# EAGLE design S7G7_footprint_simplified_w_ethernet_v1p12 (EAGLE 9.5.2)
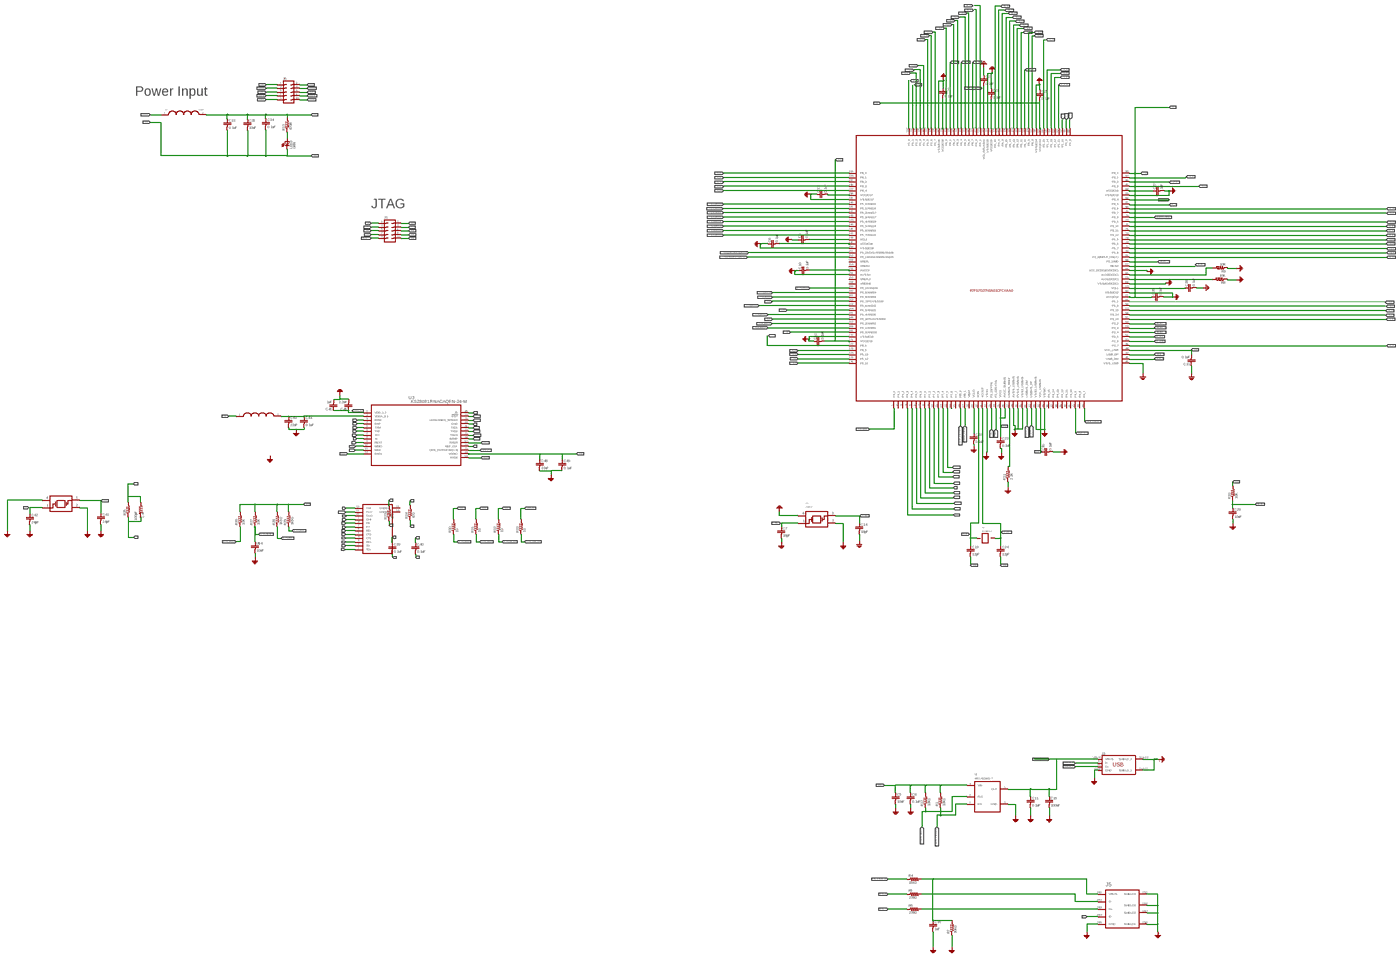
[diagram p0: schematic, sheet 1, overview]
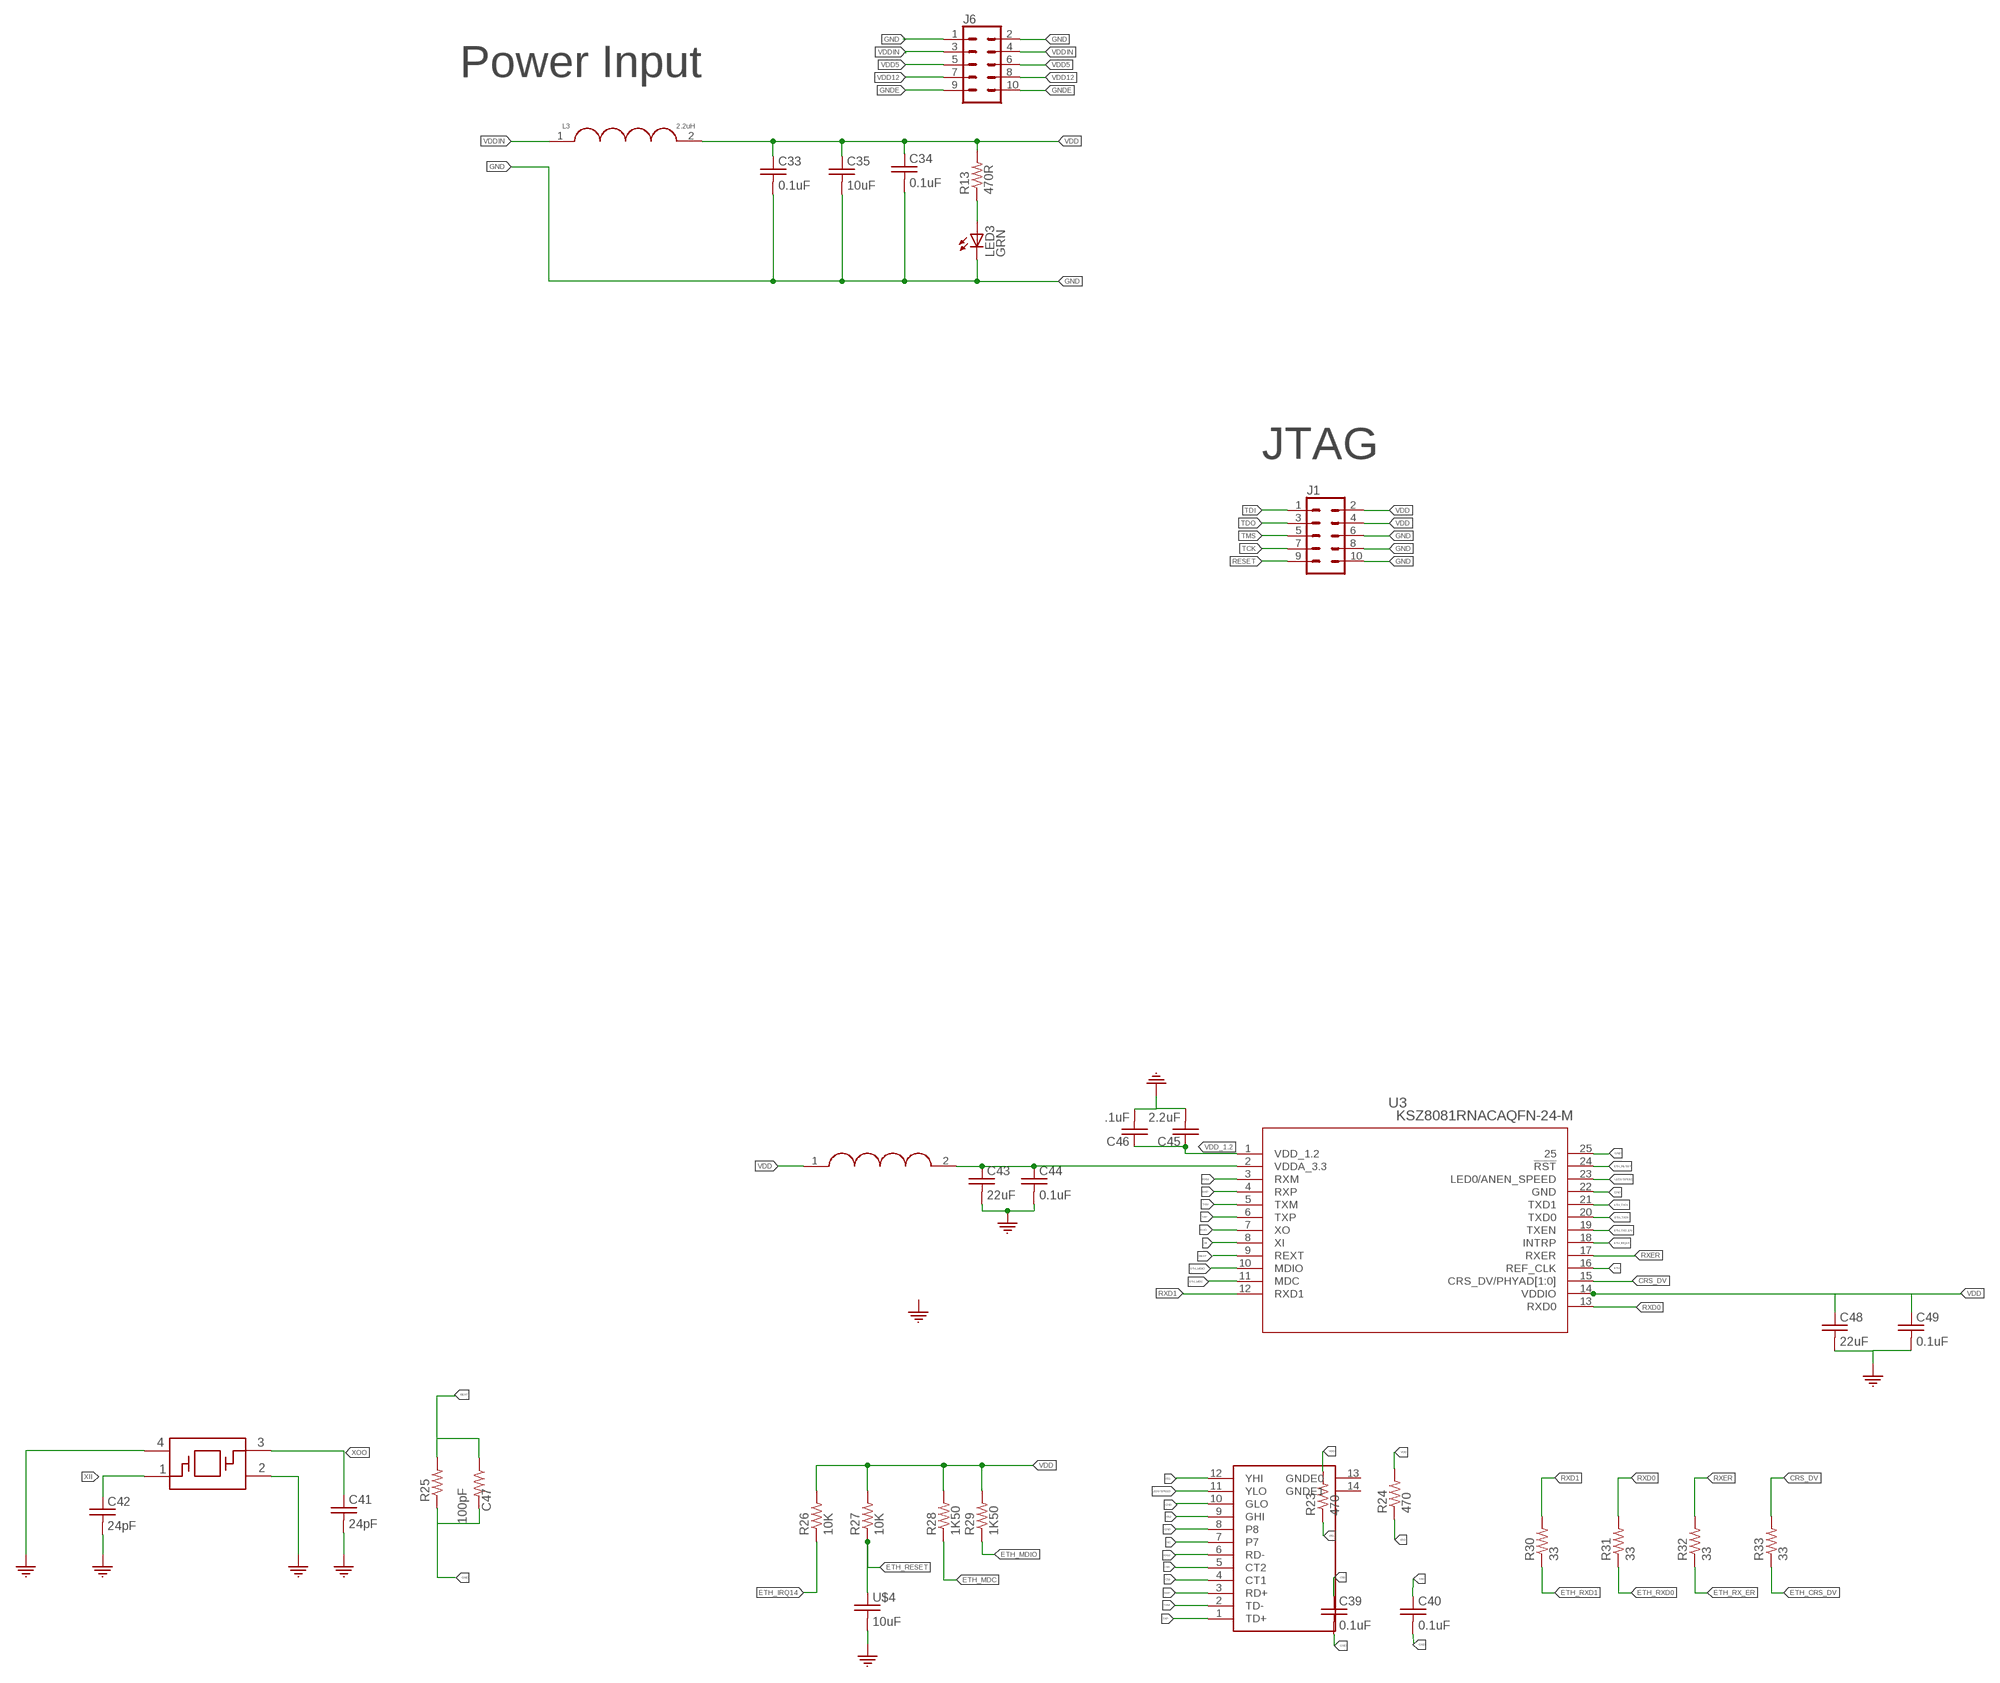
[diagram p1: schematic, sheet 1, part 1 of 4]
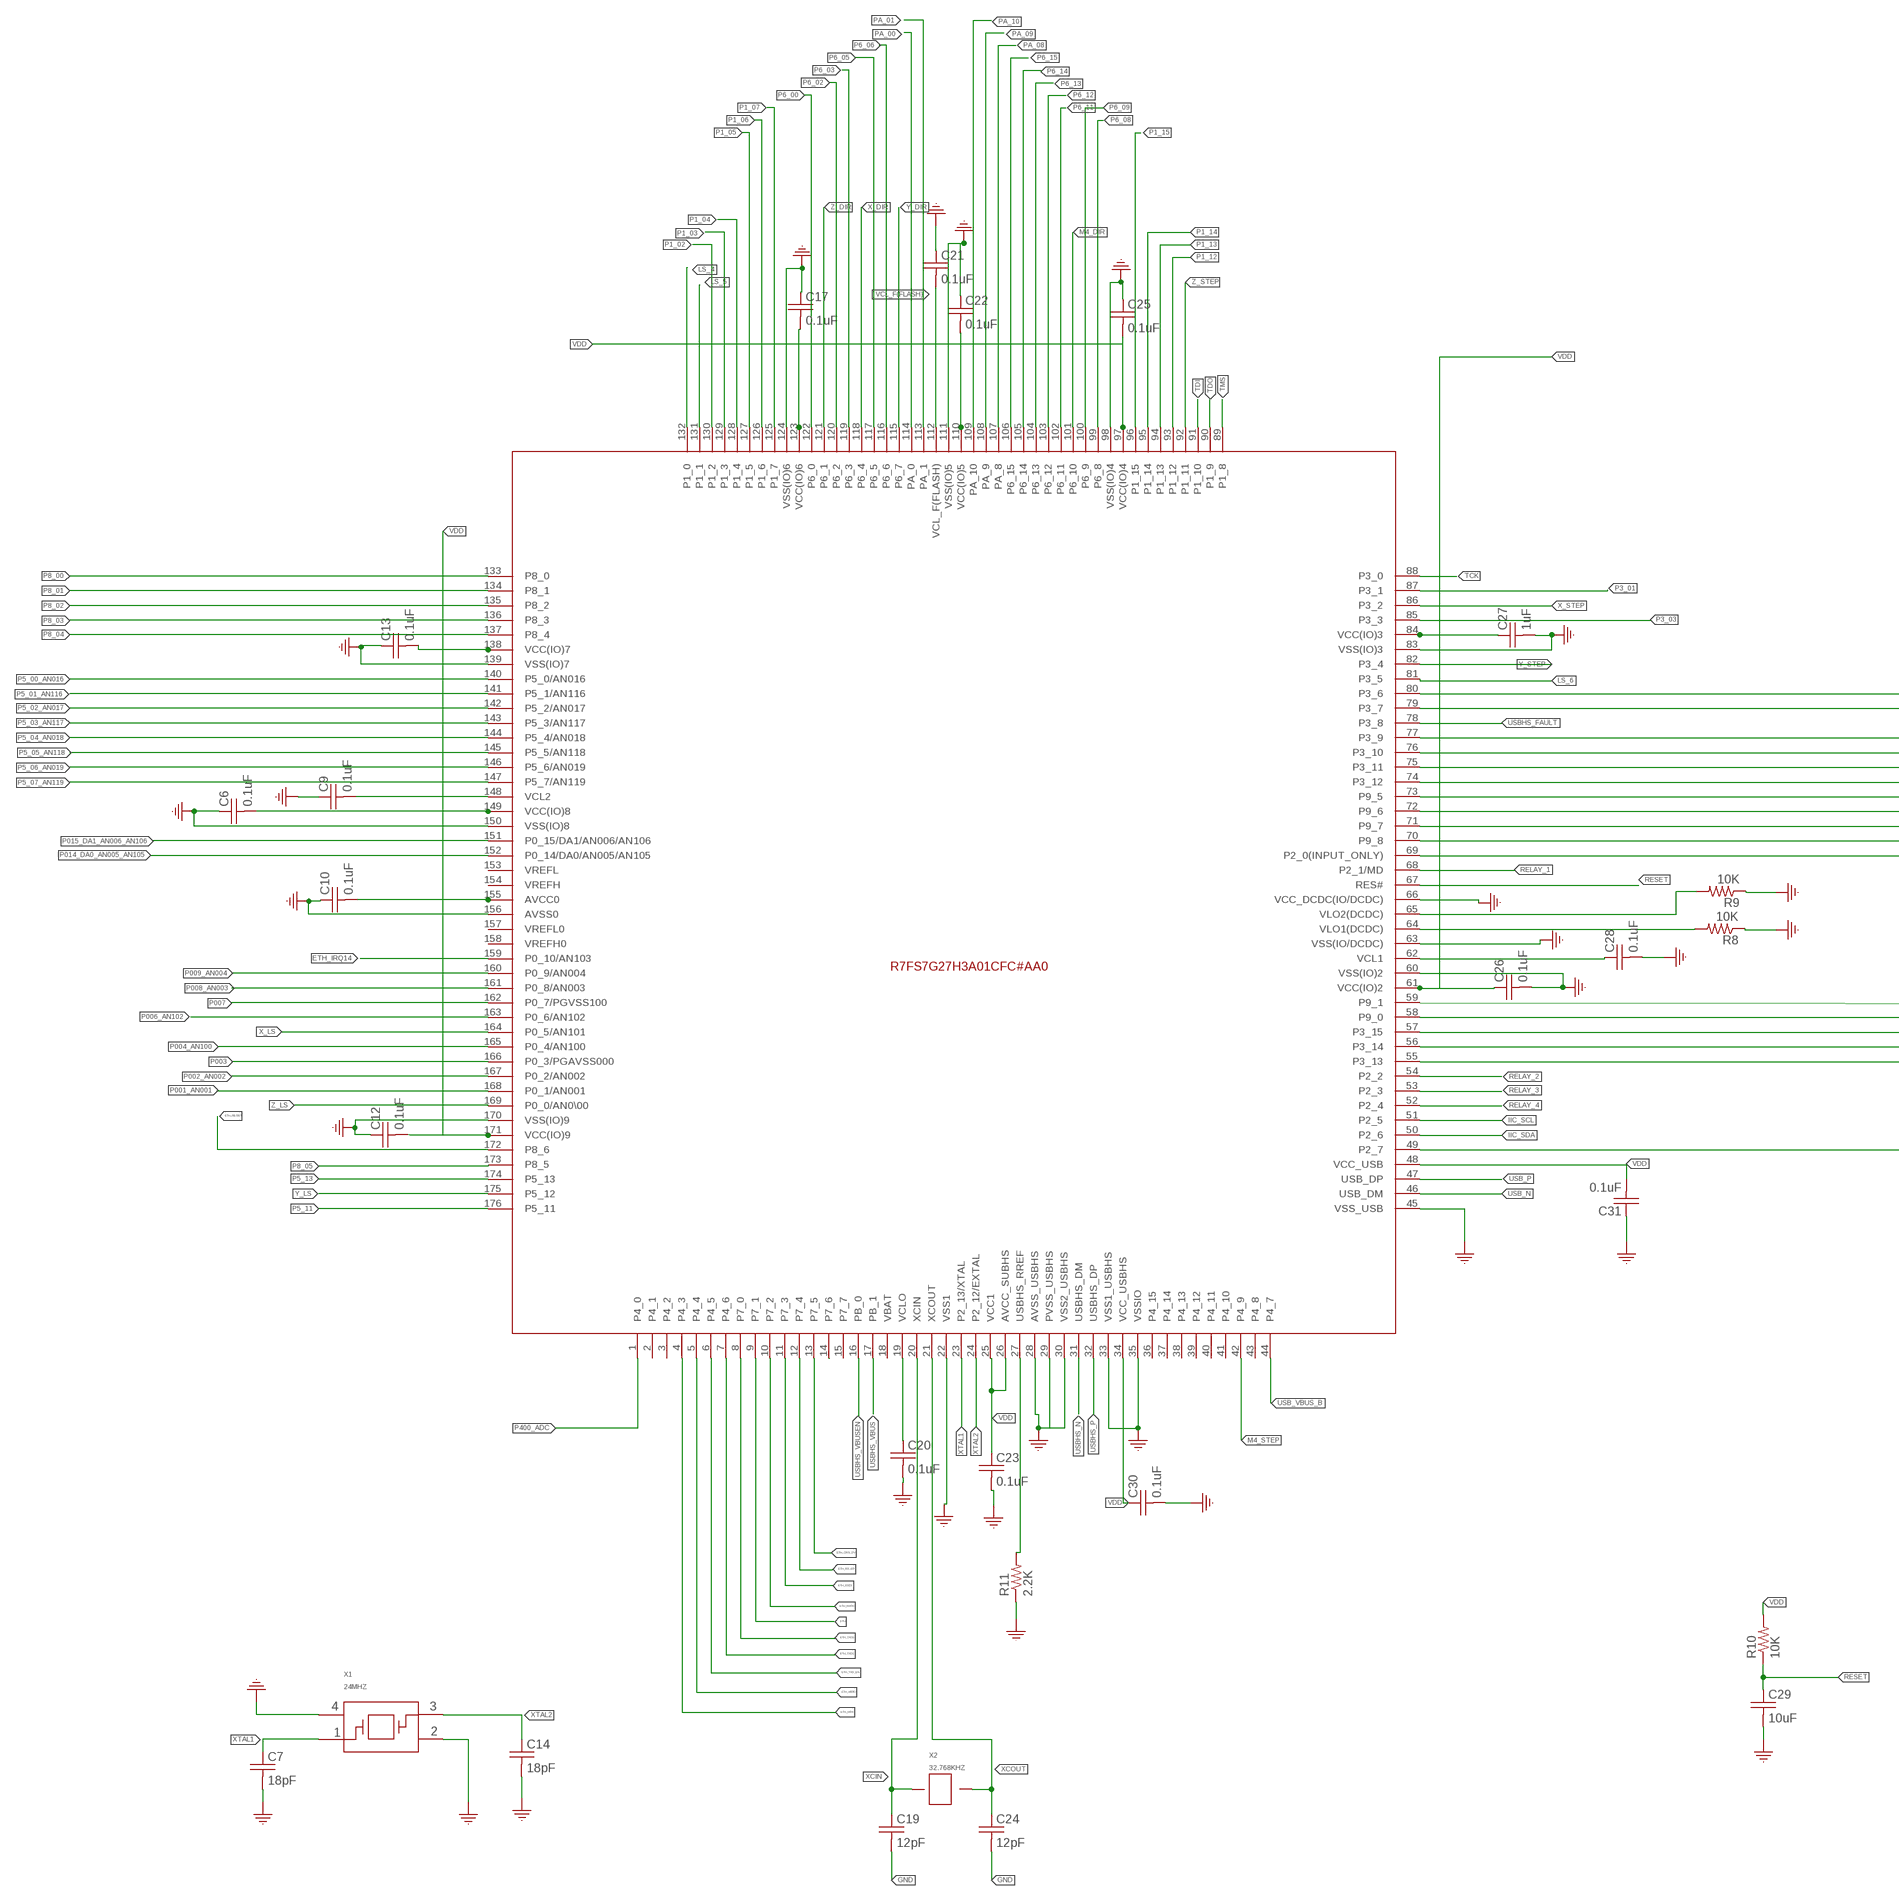
[diagram p2: schematic, sheet 1, part 2 of 4]
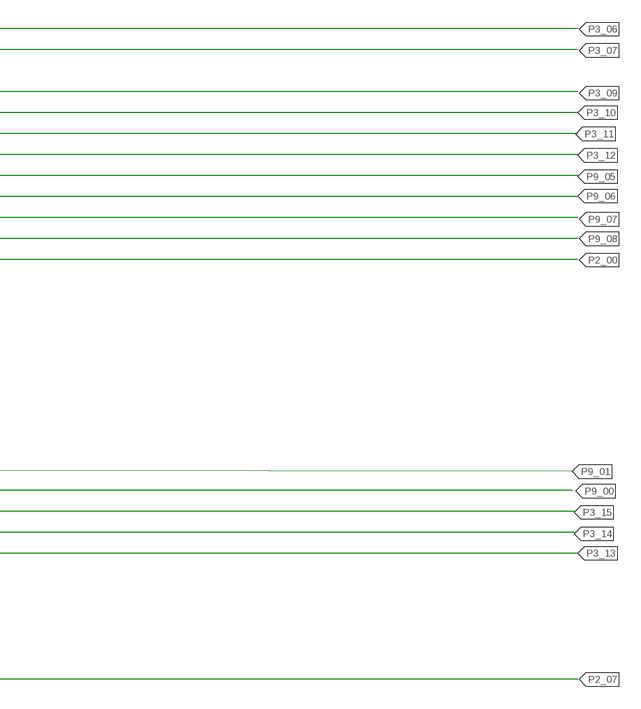
[diagram p3: schematic, sheet 1, part 3 of 4]
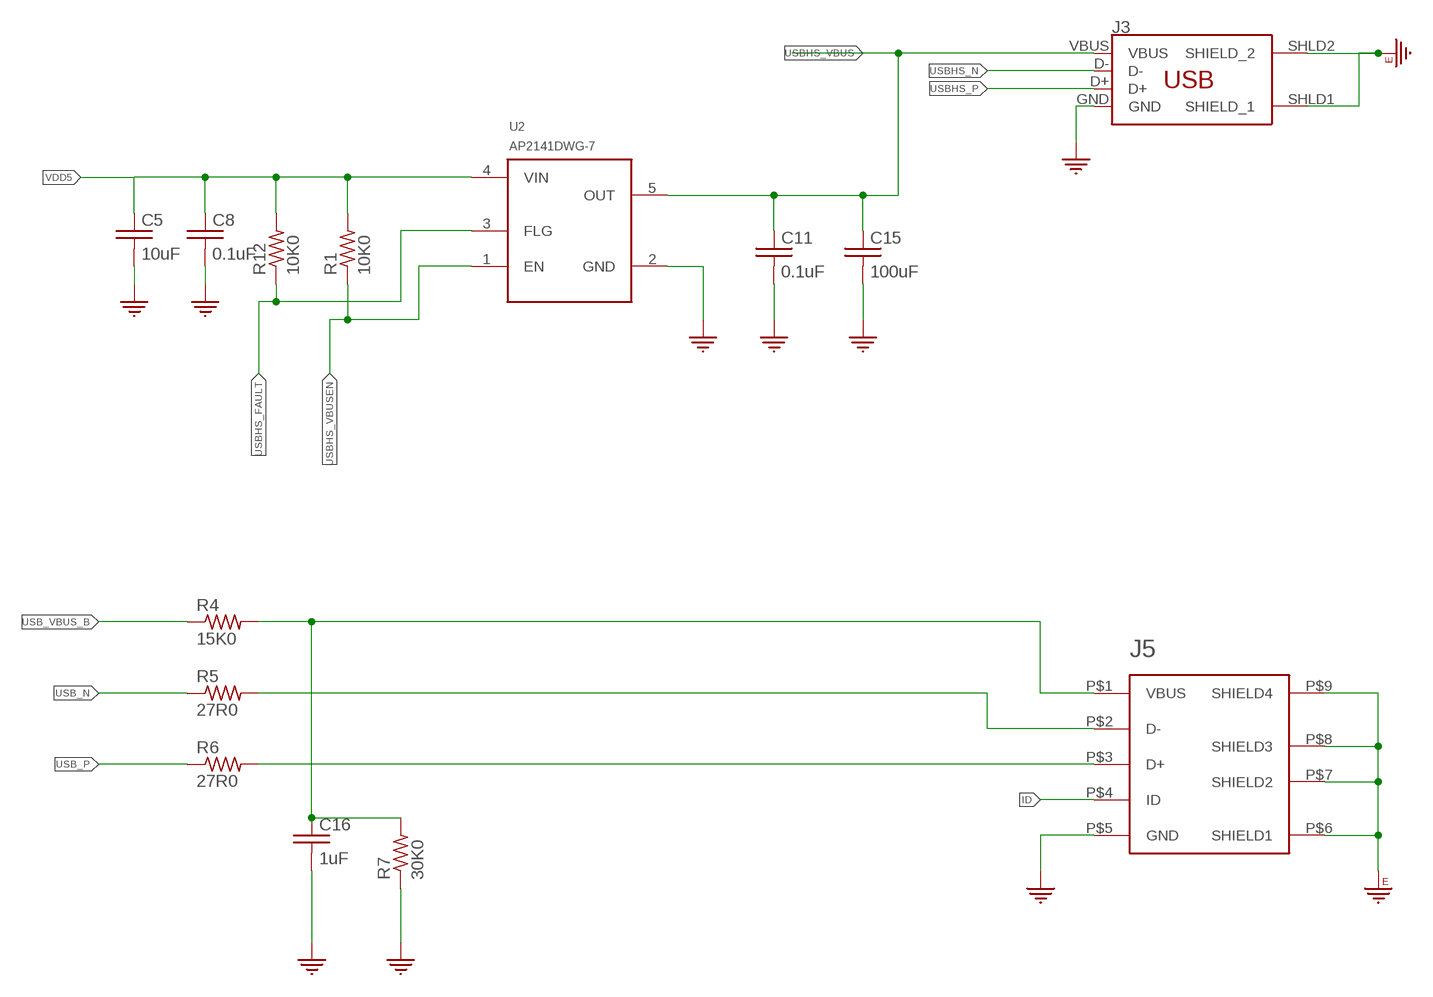
[diagram p4: schematic, sheet 1, part 4 of 4]

## Parts
C5  10uF  C_0402  [0402]
C6  0.1uF  C_0402  [0402]
C7  18pF  C_0402  [0402]
C8  0.1uF  C_0402  [0402]
C9  0.1uF  C_0402  [0402]
C10  0.1uF  C_0402  [0402]
C11  0.1uF  C_0402  [0402]
C12  0.1uF  C_0402  [0402]
C13  0.1uF  C_0402  [0402]
C14  18pF  C_0402  [0402]
C15  100uF  C_1210  [C1210]
C16  1uF  C_0402  [0402]
C17  0.1uF  C_0402  [0402]
C19  12pF  C_0402  [0402]
C20  0.1uF  C_0402  [0402]
C21  0.1uF  C_0402  [0402]
C22  0.1uF  C_0402  [0402]
C23  0.1uF  C_0402  [0402]
C24  12pF  C_0402  [0402]
C25  0.1uF  C_0402  [0402]
C26  0.1uF  C_0402  [0402]
C27  1uF  C_0402  [0402]
C28  0.1uF  C_0402  [0402]
C29  10uF  C_0402  [0402]
C30  0.1uF  C_0402  [0402]
C31  0.1uF  C_0402  [0402]
C33  0.1uF  C_0402  [0402]
C34  0.1uF  C_0402  [0402]
C35  10uF  C_0402  [0402]
C39  0.1uF  C_0402  [0402]
C40  0.1uF  C_0402  [0402]
C41  24pF  C_0402  [0402]
C42  24pF  C_0402  [0402]
C43  22uF  C_0603  [0603]
C44  0.1uF  C_0402  [0402]
C45  2.2uF  C_0402  [0402]
C46  .1uF  C_0402  [0402]
C47  100pF  R_0402  [0402]
C48  22uF  C_0603  [0603]
C49  0.1uF  C_0402  [0402]
FB2/2  FB_0805_120_OHM  [0805]
J1  CONN_05X2PTH  [2X5]
J3  USB_A  [USB_A_SMT]
J5  USB_MICRO-B  [USB_MICRO-B]
J6  CONN_05X2PTH  [2X5]
L3  2.2uH  INDUCTOR_1008_2.2_MH_1.3A  [1008_(2520_METRIC)]
LED3  LED_0805_GREEN  [LED_0805_GREEN]
R1  10K0  R_0402  [0402]
R4  15K0  R_0402  [0402]
R5  27R0  R_0402  [0402]
R6  27R0  R_0402  [0402]
R7  30K0  R_0402  [0402]
R8  10K  R_0402  [0402]
R9  10K  R_0402  [0402]
R10  10K  R_0402  [0402]
R11  2.2K  R_0402  [0402]
R12  10K0  R_0402  [0402]
R13  470R  R_0402  [0402]
R23  470  R_0402  [0402]
R24  470  R_0402  [0402]
R25  6k49  R_0402  [0402]
R26  10K  R_0402  [0402]
R27  10K  R_0402  [0402]
R28  1K50  R_0402  [0402]
R29  1K50  R_0402  [0402]
R30  33  R_0402  [0402]
R31  33  R_0402  [0402]
R32  33  R_0402  [0402]
R33  33  R_0402  [0402]
U2  AP2141DWG-5  [SOT-23-5]
U3  KSZ8081RNACAQFN-24-M  [QFN-24-M]
U5  S7G2_X_176  [LQFP176_24X24]
U$2  RJ45_WITH_ELEC  [RJ45_TH_ELEC]
U$3  XTAL_25_MHZ  [SMD_3225]
U$4  10uF  C_0402  [0402]
X1  24MHZ  XTAL_24_MHZ  [SMD_3225]
X2  32.768KHZ  XTAL_32.768KHZ  [SMD_X_2_PADS]

## Nets
C58: C39.P$1 U$2.4(CT1)
C60: C40.P$1 U$2.5(CT2)
CRS_DV: R33.P$2 U3.15(CRS_DV/PHYAD[1:0])
D+: J5.P$3(D+) R6.P$2
D-: J5.P$2(D-) R5.P$2
ETH: U3.16(REF_CLK) U5.9(P7_1)
ETH_CRS_DV: R33.P$1 U5.13(P7_5)
ETH_IRQ14: R26.P$1 U3.18(INTRP) U5.159(P0_10/AN103)
ETH_MDC: R28.P$1 U3.11(MDC) U5.4(P4_3)
ETH_MDIO: R29.P$1 U3.10(MDIO) U5.5(P4_4)
ETH_RESET: R27.P$1 U3.24(!RST) U5.172(P8_6) U$4.P$1
ETH_RX_ER: R32.P$1 U5.12(P7_4)
ETH_RXD0: R31.P$1 U5.10(P7_2)
ETH_RXD1: R30.P$1 U5.11(P7_3)
ETH_TXD0: U3.20(TXD0) U5.8(P7_0)
ETH_TXD1: U3.21(TXD1) U5.7(P4_6)
ETH_TXD_EN: U3.19(TXEN) U5.6(P4_5)
GND: C5.P$2 C6.P$1 C7.P$2 C8.P$2 C9.P$1 C10.P$1 C11.P$2 C12.P$1 C13.P$1 C14.P$2 C15.2 C16.P$2 C17.P$1 C19.P$2 C20.P$2 C21.P$1 C22.P$1 C23.P$2 C24.P$2 C25.P$1 C26.P$2 C27.P$2 C28.P$2 C29.P$2 C30.P$2 C31.P$1 C33.P$2 C34.P$2 C35.P$2 C39.P$2 C40.P$2 C41.P$2 C42.P$2 C43.2 C44.P$2 C45.P$2 C46.P$2 C47.P$2 C48.2 C49.P$2 J1.6 J1.8 J1.10 J3.GND J5.P$5(GND) J6.1 J6.2 LED3.C R7.P$1 R8.P$1 R9.P$1 R11.P$1 R25.P$1 U2.2(GND) U3.22(GND) U3.25 U5.22(VSS1) U5.28(AVSS_USBHS) U5.29(PVSS_USBHS) U5.30(VSS2_USBHS) U5.33(VSS1_USBHS) U5.35(VSSIO) U5.45(VSS_USB) U5.60(VSS(IO)2) U5.63(VSS(IO/DCDC)) U5.66(VCC_DCDC(IO/DCDC)) U5.83(VSS(IO)3) U5.98(VSS(IO)4) U5.111(VSS(IO)5) U5.124(VSS(IO)6) U5.139(VSS(IO)7) U5.150(VSS(IO)8) U5.156(AVSS0) U5.170(VSS(IO)9) U$2.8 U$2.10(GLO) U$3.2 U$3.4 U$4.P$2 X1.2 X1.4
GNDE: J3.SHLD1(SHIELD_1) J3.SHLD2(SHIELD_2) J5.P$6(SHIELD1) J5.P$7(SHIELD2) J5.P$8(SHIELD3) J5.P$9(SHIELD4) J6.9 J6.10
ID: J5.P$4(ID)
IIC_SCL: U5.51(P2_5)
IIC_SDA: U5.50(P2_6)
LED1/SPEED: U3.23(LED0/ANEN_SPEED) U$2.11(YLO)
LS_4: U5.132(P1_0)
LS_5: U5.131(P1_1)
LS_6: U5.81(P3_5)
M4_DIR: U5.101(P6_10)
M4_STEP: U5.42(P4_9)
N$2: R11.P$2 U5.27(USBHS_RREF)
N$3: LED3.A R13.P$1
N$9: C9.P$2 U5.148(VCL2)
N$14: C20.P$1 U5.19(VCLO)
N$17: C28.P$1 U5.62(VCL1)
N$18: R8.P$2 U5.64(VLO1(DCDC))
N$19: R9.P$2 U5.65(VLO2(DCDC))
NC: U$2.7
P1_02: U5.130(P1_2)
P1_03: U5.129(P1_3)
P1_04: U5.128(P1_4)
P1_05: U5.127(P1_5)
P1_06: U5.126(P1_6)
P1_07: U5.125(P1_7)
P1_12: U5.93(P1_12)
P1_13: U5.94(P1_13)
P1_14: U5.95(P1_14)
P1_15: U5.96(P1_15)
P001_AN001: U5.168(P0_1/AN001)
P2_00: U5.69(P2_0(INPUT_ONLY))
P2_07: U5.49(P2_7)
P002_AN002: U5.167(P0_2/AN002)
P003: U5.166(P0_3/PGAVSS000)
P3_01: U5.87(P3_1)
P3_03: U5.85(P3_3)
P3_06: U5.80(P3_6)
P3_07: U5.79(P3_7)
P3_09: U5.77(P3_9)
P3_10: U5.76(P3_10)
P3_11: U5.75(P3_11)
P3_12: U5.74(P3_12)
P3_13: U5.55(P3_13)
P3_14: U5.56(P3_14)
P3_15: U5.57(P3_15)
P004_AN100: U5.165(P0_4/AN100)
P5_00_AN016: U5.140(P5_0/AN016)
P5_01_AN116: U5.141(P5_1/AN116)
P5_02_AN017: U5.142(P5_2/AN017)
P5_03_AN117: U5.143(P5_3/AN117)
P5_04_AN018: U5.144(P5_4/AN018)
P5_05_AN118: U5.145(P5_5/AN118)
P5_06_AN019: U5.146(P5_6/AN019)
P5_07_AN119: U5.147(P5_7/AN119)
P5_11: U5.176(P5_11)
P5_13: U5.174(P5_13)
P6_00: U5.122(P6_0)
P6_02: U5.120(P6_2)
P6_03: U5.119(P6_3)
P6_05: U5.117(P6_5)
P6_06: U5.116(P6_6)
P6_08: U5.99(P6_8)
P6_09: U5.100(P6_9)
P6_11: U5.102(P6_11)
P6_12: U5.103(P6_12)
P6_13: U5.104(P6_13)
P6_14: U5.105(P6_14)
P6_15: U5.106(P6_15)
P006_AN102: U5.163(P0_6/AN102)
P007: U5.162(P0_7/PGVSS100)
P8_00: U5.133(P8_0)
P8_01: U5.134(P8_1)
P8_02: U5.135(P8_2)
P8_03: U5.136(P8_3)
P8_04: U5.137(P8_4)
P8_05: U5.173(P8_5)
P008_AN003: U5.161(P0_8/AN003)
P9_00: U5.58(P9_0)
P9_01: U5.59(P9_1)
P9_05: U5.73(P9_5)
P9_06: U5.72(P9_6)
P9_07: U5.71(P9_7)
P9_08: U5.70(P9_8)
P009_AN004: U5.160(P0_9/AN004)
P014_DA0_AN005_AN105: U5.152(P0_14/DA0/AN005/AN105)
P015_DA1_AN006_AN106: U5.151(P0_15/DA1/AN006/AN106)
P400_ADC: U5.1(P4_0)
P706: U5.14(P7_6)
PA_00: U5.114(PA_0)
PA_01: U5.113(PA_1)
PA_08: U5.107(PA_8)
PA_09: U5.108(PA_9)
PA_10: U5.109(PA_10)
R51: R23.P$1 U$2.12(YHI)
R52: R24.P$1 U$2.9(GHI)
RELAY_1: U5.68(P2_1/MD)
RELAY_2: U5.54(P2_2)
RELAY_3: U5.53(P2_3)
RELAY_4: U5.52(P2_4)
RESET: C29.P$1 J1.9 R10.P$1 U5.67(RES#)
REXT: C47.P$1 R25.P$2 U3.9(REXT)
RXD0: R31.P$2 U3.13(RXD0)
RXD1: R30.P$2 U3.12(RXD1)
RXER: R32.P$2 U3.17(RXER)
RXM: U3.3(RXM) U$2.6(RD-)
RXP: U3.4(RXP) U$2.3(RD+)
TCK: J1.7 U5.88(P3_0)
TDI: J1.1 U5.91(P1_10)
TDO: J1.3 U5.90(P1_9)
TMS: J1.5 U5.89(P1_8)
TXM: U3.5(TXM) U$2.2(TD-)
TXP: U3.6(TXP) U$2.1(TD+)
USB_N: R5.P$1 U5.46(USB_DM)
USB_P: R6.P$1 U5.47(USB_DP)
USB_VBUS_B: R4.P$1 U5.44(P4_7)
USBHS_FAULT: R12.P$1 U2.3(FLG) U5.78(P3_8)
USBHS_N: J3.D- U5.31(USBHS_DM)
USBHS_P: J3.D+ U5.32(USBHS_DP)
USBHS_VBUS: C11.P$1 C15.1 J3.VBUS U2.5(OUT) U5.17(PB_1)
USBHS_VBUSEN: R1.P$1 U2.1(EN) U5.16(PB_0)
VBUS: C16.P$1 J5.P$1(VBUS) R4.P$2 R7.P$2
VCL_F(FLASH): C21.P$2 U5.112(VCL_F(FLASH))
VDD: C6.P$2 C10.P$2 C12.P$2 C13.P$2 C17.P$2 C22.P$2 C23.P$1 C25.P$2 C26.P$1 C27.P$1 C30.P$1 C31.P$2 C33.P$1 C34.P$1 C35.P$1 C48.1 C49.P$1 FB2/2.1 J1.2 J1.4 L3.2 R10.P$2 R13.P$2 R23.P$2 R24.P$2 R26.P$2 R27.P$2 R28.P$2 R29.P$2 U3.14(VDDIO) U5.25(VCC1) U5.26(AVCC_SUBHS) U5.34(VCC_USBHS) U5.48(VCC_USB) U5.61(VCC(IO)2) U5.84(VCC(IO)3) U5.97(VCC(IO)4) U5.110(VCC(IO)5) U5.123(VCC(IO)6) U5.138(VCC(IO)7) U5.149(VCC(IO)8) U5.155(AVCC0) U5.171(VCC(IO)9)
VDD5: C5.P$1 C8.P$1 J6.5 J6.6 R1.P$2 R12.P$2 U2.4(VIN)
VDD12: J6.7 J6.8
VDD_1.2: C45.P$1 C46.P$1 U3.1(VDD_1.2)
VDD_ENET1: C43.1 C44.P$1 FB2/2.2 U3.2(VDDA_3.3)
VDDIN: J6.3 J6.4 L3.1
X_DIR: U5.118(P6_4)
X_LS: U5.164(P0_5/AN101)
X_STEP: U5.86(P3_2)
XCIN: C19.P$1 U5.20(XCIN) X2.P$1
XCOUT: C24.P$1 U5.21(XCOUT) X2.P$2
XII: C42.P$1 U3.8(XI) U$3.1
XOO: C41.P$1 U3.7(XO) U$3.3
XTAL1: C7.P$1 U5.23(P2_13/XTAL) X1.1
XTAL2: C14.P$1 U5.24(P2_12/EXTAL) X1.3
Y_DIR: U5.115(P6_7)
Y_LS: U5.175(P5_12)
Y_STEP: U5.82(P3_4)
Z_DIR: U5.121(P6_1)
Z_LS: U5.169(P0_0/AN0\00)
Z_STEP: U5.92(P1_11)
Unconnected: U5.2(P4_1) U5.3(P4_2) U5.15(P7_7) U5.18(VBAT) U5.36(P4_15) U5.37(P4_14) U5.38(P4_13) U5.39(P4_12) U5.40(P4_11) U5.41(P4_10) U5.43(P4_8) U5.153(VREFL) U5.154(VREFH) U5.157(VREFL0) U5.158(VREFH0) U$2.13(GNDE0) U$2.14(GNDE1)

## Notes on the sheet
- Power Input
- JTAG

## Library data of the parts
C5-C14 C16 C17 C19-C31 C33-C35 C39-C42 C44-C46 C49 U$4 = 3D_MIG_Controller:C_0402
C15 = 3D_MIG_Controller:C_1210
C43 C48 = 3D_MIG_Controller:C_0603
C47 R1 R4-R13 R23-R33 = 3D_MIG_Controller:R_0402
FB2/2 = 3D_MIG_Controller:FB_0805_120_OHM
J1 J6 = 3D_MIG_Controller:CONN_05X2: Multi connection point. Often used as Generic Header-pin footprint for 0.1 inch spaced/style header connections For AVR SPI programming port, see special device with nice symbol: "AVR_SPI_PROG_5x2.dev" You can populate with any combo of single row headers, but if you'd like an exact match, check these: 2x5 AVR ICSP Male Header <https://www.sparkfun.com/products/778> (PRT-00778) 2x5 Pin Shrouded Header <https://www.sparkfun.com/products/8506> (PRT-08506) On any of the 0.1 inch spaced packages, you can populate with these: Break Away Headers - Straight <https://www.sparkfun.com/products/116> (PRT-00116) Break Away Male Headers - Right Angle <https://www.sparkfun.com/products/553> (PRT-00553) Female Headers <https://www.sparkfun.com/products/115> (PRT-00115) Break Away Headers - Machine Pin <https://www.sparkfun.com/products/117> (PRT-00117) Break Away Female Headers - Swiss Machine Pin <https://www.sparkfun.com/products/743> (PRT-00743) Special note: the shrouded connector mates well with our 5x2 ribbon cables: 2x5 Pin IDC Ribbon Cable <https://www.sparkfun.com/products/8535> (PRT-08535); PROD_ID: CONN-08499; SF_ID: PRT-0778
J3 = 3D_MIG_Controller:USB_A: USB-A Connector Male and female variants, as well as PTH and SMT variants SparkFun Products: SparkFun XBee Explorer Dongle <https://www.sparkfun.com/products/11697> PTH Male SparkFun MicroView-USB Programmer <https://www.sparkfun.com/products/12924> SMT Male SparkFun USB Type A Female Breakout <https://www.sparkfun.com/products/12700> SMT Female
J5 = 3D_MIG_Controller:USB_MICRO-B
L3 = 3D_MIG_Controller:INDUCTOR_1008_2.2_MH_1.3A
LED3 = 3D_MIG_Controller:LED_0805_GREEN
U2 = 3D_MIG_Controller:AP2141DWG-5
U3 = 3D_MIG_Controller:KSZ8081RNACA; MANUFACTURER_PART_NUMBER: KSZ8081RNACA; VENDOR: Micrel
U5 = 3D_MIG_Controller:S7G2_X_176
U$2 = 3D_MIG_Controller:RJ45_WITH_ELEC
U$3 = 3D_MIG_Controller:XTAL_25_MHZ
X1 = 3D_MIG_Controller:XTAL_24_MHZ
X2 = 3D_MIG_Controller:XTAL_32.768KHZ

## Board
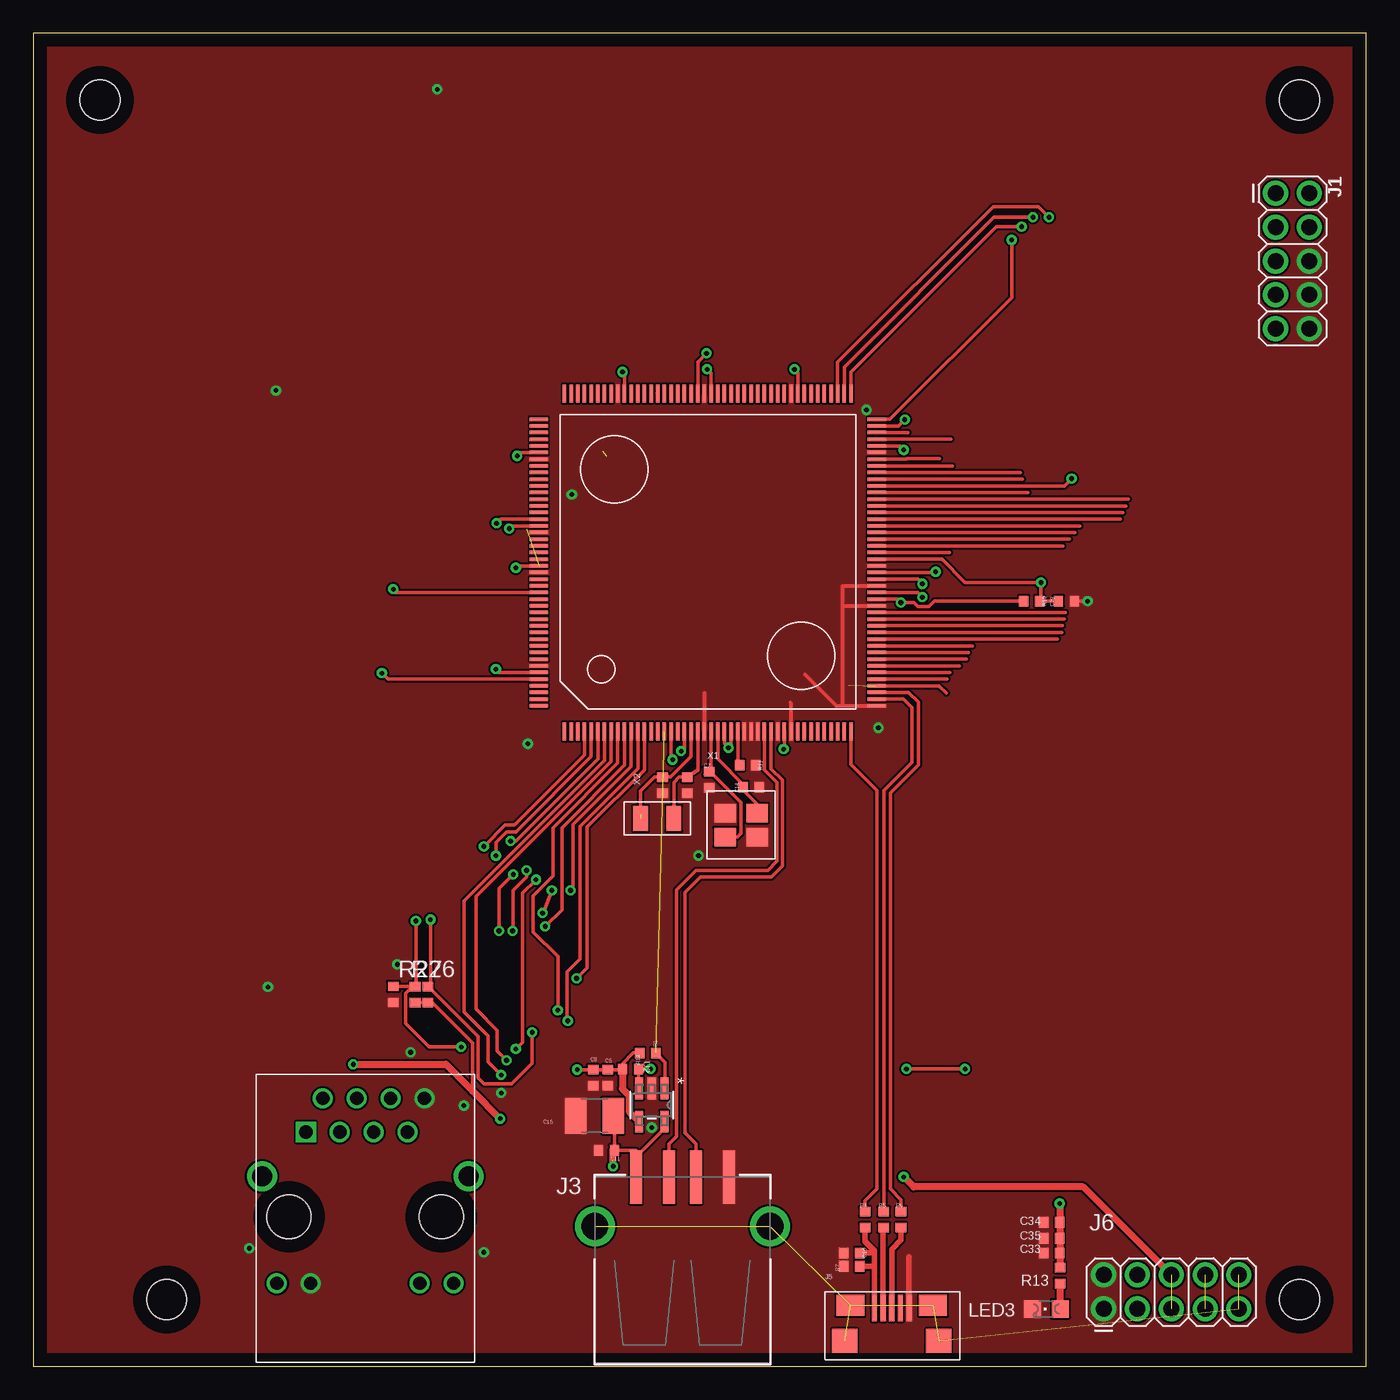
[diagram p5: board, top side]
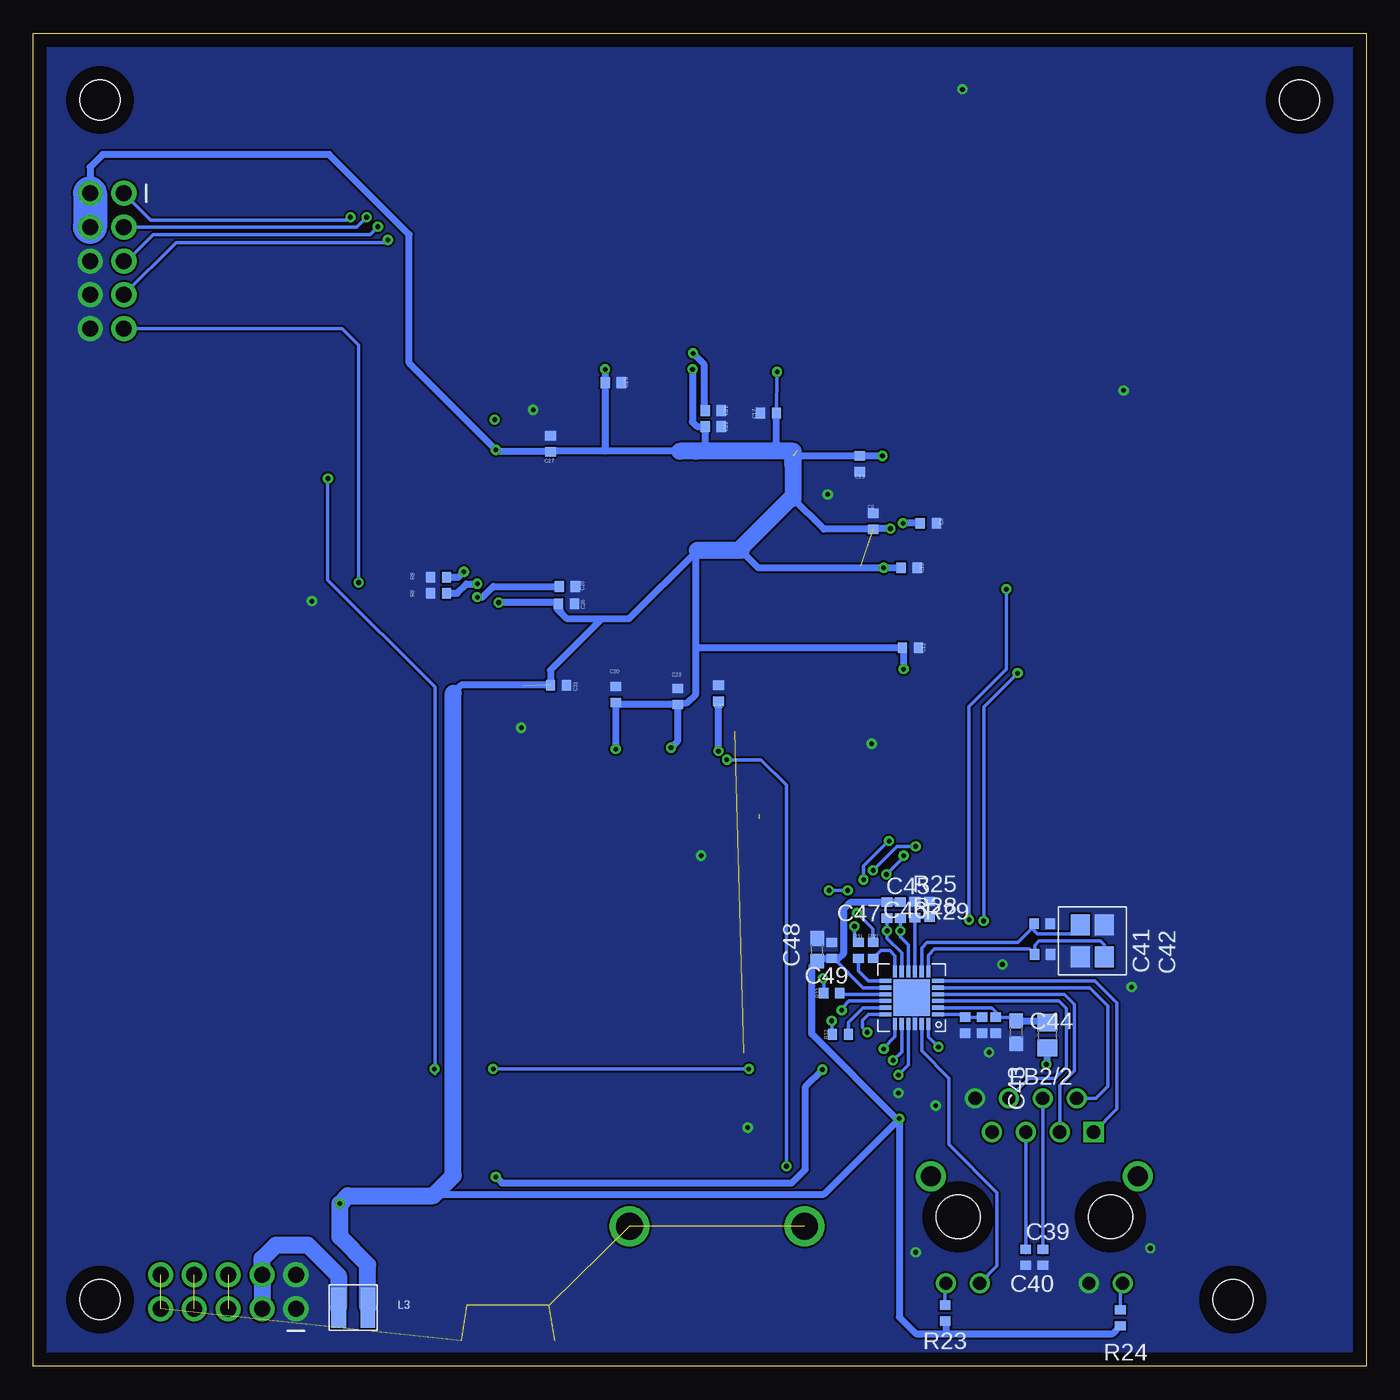
[diagram p6: board, bottom side, seen from below]

Size 100 x 100 mm. Coordinates in mm from the lower left corner, seen from the top.
Outline: 0,0 100,0 100,100 0,100 0,0
Copper layers (1*16): Top 0.035mm / dielectric 1.5mm / Bottom 0.035mm
Design rules "default": minimum track width 6mil, minimum drill 0.35mm, track to track 6mil, track to pad 6mil, pad to pad 6mil, via to via 6mil, smd to smd 6mil, copper to edge 40mil, drill to drill 6mil, minimum pad ring 10mil, minimum via ring 8mil, stop-mask expansion 4mil, vias tented up to drill 0mil, thermal gap 10mil
Holes 3 mm at 5,95 95,95 95,5 10,5

### Footprints (pad centres in the part's own frame; a part is rotated, then mirrored left to right if it is on the bottom)
0402 = smd 0.8 x 0.7: P$1 0,0.6; P$2 0,-0.6
C1210 = smd 1.6 x 2.7: 1 -1.4,0; 2 1.4,0
0603 = smd 1.1 x 1: 1 -0.85,0; 2 0.85,0
0805 = smd 1.3 x 1.5: 1 -0.95,0; 2 0.95,0
2X5 = drill 1.2 pad 1.88: 1 0,0; 2 0,2.54; 3 2.54,0; 4 2.54,2.54; 5 5.08,0; 6 5.08,2.54; 7 7.62,0; 8 7.62,2.54; 9 10.16,0; 10 10.16,2.54
USB_A_SMT = smd 4 x 0.9: D+ 6.7,-1; D- 6.7,1; GND 6.7,-3.5; VBUS 6.7,3.5 | drill 2: SHLD1 3,-6.566; SHLD2 3,6.566
USB_MICRO-B = smd 0.4 x 2: P$1 -1.3,2.475; P$2 -0.65,2.475; P$3 0,2.475; P$4 0.65,2.475; P$5 1.3,2.475 | smd 2.1 x 1.6: P$6 -3.1,2.675; P$7 3.1,2.675 | smd 1.9 x 1.8: P$8 -3.525,0; P$9 3.525,0
1008_(2520_METRIC) = smd 3 x 1.1: 1 0,1.1; 2 0,-1.1
LED_0805_GREEN = smd 1.3 x 1.3: A 0,-1.05; C 0,1.05
SOT-23-5 = smd 1.626 x 0.61: 1 -1.245,0.95; 2 -1.245,0; 3 -1.245,-0.95; 4 1.245,-0.95; 5 1.245,0.95
QFN-24-M = smd 0.864 x 0.305: 1 -1.968,1.25; 2 -1.968,0.75; 3 -1.968,0.25; 4 -1.968,-0.25; 5 -1.968,-0.75; 6 -1.968,-1.25; 13 1.968,-1.25; 14 1.968,-0.75; 15 1.968,-0.25; 16 1.968,0.25; 17 1.968,0.75; 18 1.968,1.25 | smd 0.305 x 0.864: 7 -1.25,-1.968; 8 -0.75,-1.968; 9 -0.25,-1.968; 10 0.25,-1.968; 11 0.75,-1.968; 12 1.25,-1.968; 19 1.25,1.968; 20 0.75,1.968; 21 0.25,1.968; 22 -0.25,1.968; 23 -0.75,1.968; 24 -1.25,1.968 | smd 2.743 x 2.743: 25 0,0
LQFP176_24X24 = smd 1.372 x 0.254: 1 -12.675,10.75; 2 -12.675,10.25; 3 -12.675,9.75; 4 -12.675,9.25; 5 -12.675,8.75; 6 -12.675,8.25; 7 -12.675,7.75; 8 -12.675,7.25; 9 -12.675,6.75; 10 -12.675,6.25; 11 -12.675,5.75; 12 -12.675,5.25; 13 -12.675,4.75; 14 -12.675,4.25; 15 -12.675,3.75; 16 -12.675,3.25; 17 -12.675,2.75; 18 -12.675,2.25; 19 -12.675,1.75; 20 -12.675,1.25; 21 -12.675,0.75; 22 -12.675,0.25; 23 -12.675,-0.25; 24 -12.675,-0.75; 25 -12.675,-1.25; 26 -12.675,-1.75; 27 -12.675,-2.25; 28 -12.675,-2.75; 29 -12.675,-3.25; 30 -12.675,-3.75; 31 -12.675,-4.25; 32 -12.675,-4.75; 33 -12.675,-5.25; 34 -12.675,-5.75; 35 -12.675,-6.25; 36 -12.675,-6.75; 37 -12.675,-7.25; 38 -12.675,-7.75; 39 -12.675,-8.25; 40 -12.675,-8.75; 41 -12.675,-9.25; 42 -12.675,-9.75; 43 -12.675,-10.25; 44 -12.675,-10.75; 89 12.675,-10.75; 90 12.675,-10.25; 91 12.675,-9.75; 92 12.675,-9.25; 93 12.675,-8.75; 94 12.675,-8.25; 95 12.675,-7.75; 96 12.675,-7.25; 97 12.675,-6.75; 98 12.675,-6.25; 99 12.675,-5.75; 100 12.675,-5.25; 101 12.675,-4.75; 102 12.675,-4.25; 103 12.675,-3.75; 104 12.675,-3.25; 105 12.675,-2.75; 106 12.675,-2.25; 107 12.675,-1.75; 108 12.675,-1.25; 109 12.675,-0.75; 110 12.675,-0.25; 111 12.675,0.25; 112 12.675,0.75; 113 12.675,1.25; 114 12.675,1.75; 115 12.675,2.25; 116 12.675,2.75; 117 12.675,3.25; 118 12.675,3.75; 119 12.675,4.25; 120 12.675,4.75; 121 12.675,5.25; 122 12.675,5.75; 123 12.675,6.25; 124 12.675,6.75; 125 12.675,7.25; 126 12.675,7.75; 127 12.675,8.25; 128 12.675,8.75; 129 12.675,9.25; 130 12.675,9.75; 131 12.675,10.25; 132 12.675,10.75 | smd 0.254 x 1.372: 45 -10.75,-12.675; 46 -10.25,-12.675; 47 -9.75,-12.675; 48 -9.25,-12.675; 49 -8.75,-12.675; 50 -8.25,-12.675; 51 -7.75,-12.675; 52 -7.25,-12.675; 53 -6.75,-12.675; 54 -6.25,-12.675; 55 -5.75,-12.675; 56 -5.25,-12.675; 57 -4.75,-12.675; 58 -4.25,-12.675; 59 -3.75,-12.675; 60 -3.25,-12.675; 61 -2.75,-12.675; 62 -2.25,-12.675; 63 -1.75,-12.675; 64 -1.25,-12.675; 65 -0.75,-12.675; 66 -0.25,-12.675; 67 0.25,-12.675; 68 0.75,-12.675; 69 1.25,-12.675; 70 1.75,-12.675; 71 2.25,-12.675; 72 2.75,-12.675; 73 3.25,-12.675; 74 3.75,-12.675; 75 4.25,-12.675; 76 4.75,-12.675; 77 5.25,-12.675; 78 5.75,-12.675; 79 6.25,-12.675; 80 6.75,-12.675; 81 7.25,-12.675; 82 7.75,-12.675; 83 8.25,-12.675; 84 8.75,-12.675; 85 9.25,-12.675; 86 9.75,-12.675; 87 10.25,-12.675; 88 10.75,-12.675; 133 10.75,12.675; 134 10.25,12.675; 135 9.75,12.675; 136 9.25,12.675; 137 8.75,12.675; 138 8.25,12.675; 139 7.75,12.675; 140 7.25,12.675; 141 6.75,12.675; 142 6.25,12.675; 143 5.75,12.675; 144 5.25,12.675; 145 4.75,12.675; 146 4.25,12.675; 147 3.75,12.675; 148 3.25,12.675; 149 2.75,12.675; 150 2.25,12.675; 151 1.75,12.675; 152 1.25,12.675; 153 0.75,12.675; 154 0.25,12.675; 155 -0.25,12.675; 156 -0.75,12.675; 157 -1.25,12.675; 158 -1.75,12.675; 159 -2.25,12.675; 160 -2.75,12.675; 161 -3.25,12.675; 162 -3.75,12.675; 163 -4.25,12.675; 164 -4.75,12.675; 165 -5.25,12.675; 166 -5.75,12.675; 167 -6.25,12.675; 168 -6.75,12.675; 169 -7.25,12.675; 170 -7.75,12.675; 171 -8.25,12.675; 172 -8.75,12.675; 173 -9.25,12.675; 174 -9.75,12.675; 175 -10.25,12.675; 176 -10.75,12.675
RJ45_TH_ELEC = drill 1 square: 1 -4.45,-2.54 | drill 1: 2 -3.18,0; 3 -1.91,-2.54; 4 -0.635,0; 5 0.635,-2.54; 6 1.91,0; 7 3.17,-2.54; 8 4.445,0; 9 -6.63,-13.88; 10 -4.09,-13.88; 11 4.09,-13.88; 12 6.63,-13.88 | drill 1.5: 13 -7.75,-5.84; 14 7.75,-5.84 | hole 3.299: 5.715,-8.89; -5.715,-8.89
SMD_3225 = smd 1.6 x 1.4: 1 -1.2,-0.9; 2 1.2,-0.9; 3 1.2,0.9; 4 -1.2,0.9
SMD_X_2_PADS = smd 1.9 x 1.1: P$1 0,1.25; P$2 0,-1.25

### Placement (x,y rotation side)
C5  43.1,21.65 0 top
C6  37,63.4 0 bottom
C7  50.7,44 0 top
C8  42,21.65 0 top
C9  32.85,63.25 270 bottom
C10  34.3,59.9 270 bottom
C11  43,16.2 270 top
C12  34.2,53.9 270 bottom
C13  38,67.7 180 bottom
C14  53.85,43.45 90 top
C15  42.1,18.8 180 top
C16  61.4,8.5 270 top
C17  44.85,71.5 90 bottom
C19  47.2,43.6 0 top
C20  48.6,50.5 180 bottom
C21  49,71.7 270 bottom
C22  49,70.5 270 bottom
C23  51.65,50.25 180 bottom
C24  49.05,43.6 0 top
C25  56.5,73.8 270 bottom
C26  60,57.2 90 bottom
C27  61.2,69.2 180 bottom
C28  59.95,58.5 90 bottom
C29  77.5,57.4 90 top
C30  56.3,50.4 180 bottom
C31  60.6,51.1 270 bottom
C33  76.4,8.5 270 top
C34  76.4,10.8 270 top
C35  76.4,9.6 270 top
C39  24.26,8.17 0 bottom
C40  25.54,8.17 0 bottom
C41  24.27,30.89 90 bottom
C42  24.32,33.21 90 bottom
C43  26.26,25.06 270 bottom
C44  27.79,25.58 0 bottom
C45  28.82,25.58 0 bottom
C46  30.1,25.58 0 bottom
C47  33.86,34.24 180 bottom
C48  41.2,31.25 90 bottom
C49  40.1,31.2 180 bottom
FB2/2  23.92,24.83 90 bottom
J1  93.2,88 270 top
J3  48.7,7.5 90 top
J5  64.4,1.9 0 top
J6  80.3,4.3 0 top
L3  76,4.4 90 bottom
LED3  76,4.3 90 top
R1  46.1,23.5 270 top
R4  62.4,11 0 top
R5  63.8,11 0 top
R6  65.1,11 0 top
R7  61.4,7.5 90 top
R8  69.6,58 90 bottom
R9  69.6,59.2 90 bottom
R10  74.9,57.4 270 top
R11  53.6,45.1 270 top
R12  44.8,22.3 270 top
R13  77.03,6.81 180 top
R23  31.59,3.98 0 bottom
R24  18.44,3.63 0 bottom
R25  32.76,34.27 0 bottom
R26  29.61,27.88 0 top
R27  28.64,27.88 0 top
R28  35.96,34.22 180 bottom
R29  34.94,34.22 180 bottom
R30  37,31.2 0 bottom
R31  38.1,31.2 0 bottom
R32  39.45,24.9 90 bottom
R33  40.1,28 90 bottom
U2  46.4,19.6 270 top
U3  34.1,27.65 180 bottom
U5  50.6,60.3 90 top
U$2  24.9,20.1 0 top
U$3  20.55,31.91 270 bottom
U$4  27.01,27.9 0 top
X1  53.1,40.6 0 top
X2  46.8,41.1 90 top

### Tracks (layer width: path | path; a pad name or v marks a point on that pad's centre or on a via)
C58
  Bottom 0.254: U$2.4 24.27,8.5 C39.P$1
C60
  Bottom 0.254: U$2.5 25.54,8.5 C40.P$1
CRS_DV
  Bottom 0.254: U3.15 39.4,27.9 R33.P$2
D+
  Top 0.4: J5.P$3 64.4,8.78 65.1,9.47 R6.P$2
D-
  Top 0.4: J5.P$2 63.75,10.35 R5.P$2
ETH  (via drill 0.35)
  Top 0.254: U5.9 43.85,45.25 39,40.4 39,36.8 37.5,35.3 37.5,32.6 39.35,30.75 v39.35,26.7
  Bottom 0.254: U3.16 38.8,27.4 39.35,26.85 v39.35,26.7
ETH_CRS_DV  (via drill 0.35)
  Top 0.254: U5.13 45.85,44.75 41.55,40.45 41.55,29.9 v40.75,29.1
  Bottom 0.254: v40.75,29.1 40.7,29.05 R33.P$1
ETH_IRQ14  (via drill 0.35)
  Top 0.254: U5.159 27.15,58.05 v27,58.3 | v37.43,25.05 37.43,22.73 35.89,21.19 33.81,21.19 33.36,21.64 33.36,24.73 R26.P$1 29.8,28.67 v29.8,33.5
  Bottom 0.254: v27,58.3 27,52.3 29.8,49.5 v29.8,33.5 | U3.18 37.35,26.4 37.8,25.95 37.8,25.42 v37.43,25.05
ETH_MDC  (via drill 0.35)
  Top 0.254: U5.4 41.35,45.85 36.1,40.6 35.4,40.6 v33.8,39 | v37,37.2 37,36.7 36,35.7 36,32.71 v35.95,32.66
  Bottom 0.254: U3.11 34.85,31 35.96,32.11 v35.95,32.66 R28.P$1 | v33.8,39 35.2,39 v37,37.2
ETH_MDIO  (via drill 0.35)
  Top 0.254: U5.5 41.85,45.75 36.2,40.1 35.5,40.1 34.7,39.3 v34.7,38.3 | v34.94,32.65 34.94,35.85 v35.99,36.9 v36,36.9
  Bottom 0.254: U3.10 34.35,31.6 34.94,32.19 v34.94,32.65 R29.P$1 | v34.7,38.3 34.7,38.2 v36,36.9
ETH_RESET  (via drill 0.35)
  Top 0.254: v26.15,52 26.6,51.55 U5.172 | v32.1,23.95 29.7,23.95 27.94,25.71 27.94,27.98 28.44,28.48 | 28.44,28.48 R27.P$1 28.7,28.54 v28.7,33.4 | 28.44,28.48 27.03,28.48 U$4.P$1
  Bottom 0.254: U3.24 32.85,24.7 v32.1,23.95 | v26.15,52 28.7,49.45 v28.7,33.4
ETH_RX_ER  (via drill 0.35)
  Top 0.254: U5.12 45.35,44.85 41,40.5 41,30.55 40.05,29.6 40.05,25.95 v40.1,25.9
  Bottom 0.254: R32.P$1 40.1,24.95 v40.1,25.9
ETH_RXD0  (via drill 0.35)
  Top 0.254: U5.10 44.35,45.1 39.65,40.4 39.65,34.25 v38.4,33
  Bottom 0.254: v38.4,33 38.4,32.1 R31.P$1
ETH_RXD1  (via drill 0.35)
  Top 0.254: U5.11 44.85,45 40.5,40.65 40.5,35.9 v40.3,35.7 | v38.9,35.69 38.29,34.09 v38.2,34
  Bottom 0.254: v38.2,34 37,32.8 R30.P$1 | v40.3,35.7 v38.9,35.69
ETH_TXD0  (via drill 0.35)
  Top 0.254: U5.8 43.35,45.38 33.2,35.23 33.2,26.8 34.8,25.2 34.8,23.65 v35.5,22.95
  Bottom 0.254: U3.20 34.85,23.6 v35.5,22.95
ETH_TXD1  (via drill 0.35)
  Top 0.254: U5.7 42.85,45.45 32.3,34.9 32.3,26.6 34.1,24.8 34.1,22.85 v35.1,21.85
  Bottom 0.254: U3.21 34.35,22.6 v35.1,21.85
ETH_TXD_EN  (via drill 0.35)
  Top 0.254: U5.6 42.35,45.55 36.2,39.4 v35.8,39.4 | v36.2,23.8 36.71,24.31 36.71,35.5 v37.71,36.5
  Bottom 0.254: U3.19 35.35,24.75 36.2,23.9 v36.2,23.8 | v35.8,39.4 35.83,39.4 37.71,37.52 v37.71,36.5
GND  (via drill 0.35)
  Top 0.254: U5.22 50.35,50.5 | 60.7,57.05 U5.60 | 60.7,49.55 60.7,57.05 | U5.63 60.7,58.55 60.7,57.05 | U5.35 56.85,49.75 56.8,49.8 | U5.45 60.25,49.55 57.9,51.9 | C29.P$2 v79.1,57.4
  Top 0.4: J5.P$5 65.7,8.2
  other vias: 63.4,47.9 62.5,71.75 37.1,46.7 40.4,65.4 18.2,73.2 30.3,95.8 28.3,23.55 32.3,19.55 27.3,30.15 33.8,8.55 16.2,8.85 17.6,28.45 35.1,20.5 46.4,17.9 49.9,38.3
  pour Bottom (no thermals): 67,0 100,0 100,100 0,100 0,0
  pour Top (no thermals): 0,0 100,0 100,100 0,100
GNDE  (7 unrouted)
IIC_SCL
  Top 0.254: U5.51 69.49,52.55
IIC_SDA
  Top 0.254: U5.50 68.75,52.05
LED1/SPEED
  Bottom 0.254: U3.23 33.35,23.65 31.3,21.6 31.3,16.63 27.69,13.02 27.69,7.52 U$2.11
LS_6
  Top 0.254: U5.81 68.95,67.55
N$2
  Top 0.254: U5.27 52.85,45.23 R11.P$2
N$3
  Top 0.508: R13.P$1 77.03,4.32 LED3.A
N$9  (via drill 0.35)
  Top 0.254: U5.148 35.05,63.55 v34.75,63.25
  Bottom 0.508: C9.P$2 v34.75,63.25
N$14  (via drill 0.35)
  Top 0.254: U5.19 48.85,46.4 v48.6,46.15
  Bottom 0.508: v48.6,46.15 C20.P$1
N$17  (via drill 0.35)
  Top 0.254: U5.62 66.35,58.05 v66.7,57.7
  Bottom 0.508: v66.7,57.7 66.3,57.7 65.5,58.5 C28.P$1
N$18  (via drill 0.35)
  Top 0.254: U5.64 66.35,59.05 v66.7,58.7
  Bottom 0.508: v66.7,58.7 67.5,58.7 68.2,58 R8.P$2
N$19  (via drill 0.35)
  Top 0.254: U5.65 67.7,59.55 v67.7,59.6
  Bottom 0.508: R9.P$2 68.1,59.2 v67.7,59.6
P2_00
  Top 0.254: U5.69 77.25,61.55
P2_07
  Top 0.254: U5.49 68.55,51.55
P3_01  (via drill 0.35)
  Top 0.254: U5.87 64.92,70.55 v65.39,71.02
P3_03
  Top 0.254: 68.85,69.55 U5.85
P3_06
  Top 0.254: 74.05,67.05 U5.80
P3_07
  Top 0.254: 74.21,66.54 U5.79
P3_09
  Top 0.254: U5.77 74.62,65.55
P3_10
  Top 0.254: U5.76 82.15,65.05
P3_11
  Top 0.254: 81.95,64.55 U5.75
P3_12
  Top 0.254: U5.74 81.75,64.05
P3_13
  Top 0.254: 76.84,54.56 70.53,54.56 70.52,54.55 U5.55
P3_14
  Top 0.254: U5.56 77.15,55.05
P3_15
  Top 0.254: U5.57 77.22,55.56
P6_03
  Top 0.254: U5.119 46.34,72.98
P6_13
  Top 0.254: 53.88,72.95 U5.104
P6_14
  Top 0.254: U5.105 53.35,73.06 53.34,73.07
P6_15
  Top 0.254: U5.106 52.85,73.06 52.84,73.07
P9_00
  Top 0.254: U5.58 77.35,56.05
P9_01
  Top 0.254: 77.42,56.55 U5.59
P9_05
  Top 0.254: 81.55,63.55 U5.73
P9_06
  Top 0.254: 78.53,63.05 U5.72
P9_07
  Top 0.254: U5.71 78.15,62.55
P9_08
  Top 0.254: 77.72,62.05 U5.70
PA_09
  Top 0.254: U5.108 51.85,73.06 51.84,73.07
R51
  Bottom 0.254: R23.P$1 31.59,6.16 U$2.12
R52
  Bottom 0.254: R24.P$1 18.44,6.22 U$2.9
RELAY_1
  Top 0.254: U5.68 68.73,61.05
RELAY_2
  Top 0.254: U5.54 70.45,54.05
RELAY_3
  Top 0.254: U5.53 70.14,53.55
RELAY_4
  Top 0.254: U5.52 70,53.05
RESET  (via drill 0.35)
  Top 0.254: U5.67 68.15,60.55 69.9,58.8 v75.6,58.8 75.6,57.77 R10.P$1 C29.P$1
  Bottom 0.254: v75.6,58.8 75.6,76.6 76.84,77.84 J1.9
REXT
  Bottom 0.152: U3.9
  Bottom 0.254: U3.9 33.85,33.63 C47.P$1 33.83,33.67 R25.P$2
RXD0
  Bottom 0.254: U3.13 37.35,28.9 38.1,29.65 R31.P$2
RXD1
  Bottom 0.254: U3.12 35.35,30.8 35.75,31.2 36.4,31.2 R30.P$2
RXER
  Bottom 0.254: U3.17 37.75,26.9 38.85,25.8 R32.P$2
RXM
  Bottom 0.254: U$2.6 25.31,21.6 23.35,21.6 22.5,22.45 22.5,26.85 23.05,27.4 U3.3
RXP
  Bottom 0.254: U3.4 22.65,27.9 21.89,27.14 21.89,22.16 22.99,21.06 U$2.3
TCK  (via drill 0.35)
  Top 0.254: v73.4,84.5 73.4,80.17 64.28,71.05 U5.88
  Bottom 0.254: J1.7 89.28,84.3 73.6,84.3 v73.4,84.5
TDI  (via drill 0.35)
  Top 0.254: U5.91 60.34,75.32 72.03,87 75.4,87 v76.2,86.2
  Bottom 0.254: J1.1 91.2,86 76.4,86 v76.2,86.2
TDO  (via drill 0.35)
  Top 0.254: v75,86.2 72.08,86.2 60.85,74.97 U5.90
  Bottom 0.254: J1.3 75.75,85.45 v75,86.2
TMS  (via drill 0.35)
  Top 0.254: v74.15,85.5 72.25,85.5 61.35,74.6 U5.89
  Bottom 0.254: J1.5 93,82.92 91.02,84.9 74.75,84.9 v74.15,85.5
TXM
  Bottom 0.254: U3.5 20.75,28.4 19.4,27.05 19.4,21 20.3,20.1 U$2.2
TXP
  Bottom 0.254: U3.6 20.35,28.9 18.7,27.25 18.7,19.31 U$2.1
USB_N
  Top 0.254: U5.46 65.28,50.05 65.9,49.42 65.9,45.3 63.8,43.2 R5.P$1
USB_P
  Top 0.254: U5.47 65.67,50.55 66.4,49.83 66.4,45.1 64.3,43 64.3,13.3 65.1,12.5 R6.P$1
USB_VBUS_B
  Top 0.254: R4.P$1 62.4,12.4 63.3,13.3 63.3,43.2 61.35,45.15 U5.44
USBHS_FAULT  (via drill 0.35)
  Top 0.254: U2.3 45.4,20.89 R12.P$1 v46.32,22.3 | v77.9,66.6 77.35,66.05 U5.78 | v69.9,22.3 v65.5,22.3
  Bottom 0.254: v46.32,22.3 46.42,22.3 64.7,22.3 64.8,22.3 v65.5,22.3 | v77.9,66.6 77.9,58.98 69.86,50.94 69.86,21.94 v69.9,22.3
USBHS_N
  Top 0.254: J3.D- 47.7,16.7 48.25,17.25 48.25,35.75 49.7,37.2 55.1,37.2 55.8,37.9 55.8,43.8 54.85,44.75 U5.31
USBHS_P
  Top 0.254: J3.D+ 49.7,16.7 48.9,17.5 48.9,35.52 50.07,36.69 55.37,36.69 56.21,37.53 56.21,43.97 55.36,44.82 55.36,47.62 U5.32
USBHS_VBUS  (via drill 0.35)
  Top 0.254: U5.17 47.85,45.62 v47.97,45.5 | U2.5 47.35,17.86 45.2,15.71 | 45.2,15.71 45.2,16.2 C11.P$1 43.6,16.4 43.6,18.7 C15.1 | 45.2,15.71 J3.VBUS
  Top 0.508: U2.5 47.4,18.3 | v43.5,15 43.5,16.3 43.6,16.4
  Bottom 0.254: v43.5,15 43.5,43.6 45.4,45.5 v47.97,45.5
USBHS_VBUSEN  (1 unrouted)
  Top 0.254: R1.P$1 47.4,22.8 47.4,20.89 U2.1
VBUS
  Top 0.4: J5.P$1 63.1,7.5 | 63.1,7.5 63.1,8.5 | R4.P$2 62.4,9.38 63.1,8.68 63.1,8.5 | R7.P$2 63.1,7.5 | C16.P$1 63.1,8.5
VCL_F(FLASH)  (via drill 0.35)
  Top 0.254: U5.112 49.85,75.35 v50.5,76
  Bottom 0.254: C21.P$2 49.7,75.2
  Bottom 0.508: v50.5,76 49.7,75.2 49.7,71.8 C21.P$2
VDD  (via drill 0.35)  (3 unrouted)
  Top 0.254: U5.97 57.35,74.55 v57.1,74.8 | U5.110 50.85,74.5 v50.55,74.8 | U5.149 35.9,63.05 v35.7,62.85 | U5.138 36.55,68.55 v36.3,68.3 | U5.171 34.95,52.05 v34.7,52.3 | U5.155 36.35,60.05 v36.2,59.9 | U5.25 51.85,46.71 v52.16,46.4 52.35,46.59 U5.26 | U5.61 64.85,57.55 v65.1,57.3 66.07,57.3 66.36,57.01 67.2,57.01 67.59,57.4 R10.P$2 | U5.123 44.35,74.45 v44.2,74.6 | U5.84 65,69.05 v65.3,68.75 | U5.34 56.35,46.35 v56.3,46.3 | U5.48 67.96,51.05 68.5,50.51 | 32.95,20.65 32.95,24.25 29.92,27.28 R26.P$2 R27.P$2
  Top 0.508: v77,12.2 C34.P$1 C35.P$1 C33.P$1 77,7.44 R13.P$2 | v24,22.65 30.95,22.65 32.95,20.65 v35.03,18.57
  Bottom 0.152: U3.14 36.09,28.38
  Bottom 0.254: 60.7,57.3 60.42,57.3 C26.P$1 59.95,56.07 | v65.3,68.75 61.33,68.75 C27.P$1 61.42,68.65 | C17.P$2 v44.2,74.6 | C23.P$1 51.7,49.7 | R23.P$2 31.59,3.49 31.6,3.65 | U3.14 37.75,28.4 39.95,30.6 C49.P$1
  Bottom 0.508: 43,68.65 44.25,68.65 | 44.25,68.65 45,68.65 | 42.7,68.65 43,68.65 | 45,68.65 50.3,68.65 | 45.4,69.05 45,68.65 | 50.2,61.2 50.3,61.1 | 50.3,61.1 55.33,56.07 57.35,56.07 | 50.3,53.9 50.3,50.4 50.92,49.78 C23.P$1 51.65,46.91 v52.16,46.4 | 50.3,53.9 50.3,61.1 | v56.3,46.3 C30.P$1 56.2,49.7 51.7,49.7 | 57.35,56.07 61.21,52.22 C31.P$2 67.9,51.1 68.5,50.5 | 57.35,56.07 59.95,56.07 60.7,56.82 60.7,57.3 | C26.P$1 60.7,57.3 | 60.7,57.3 v65.1,57.3 | 44.25,68.65 C17.P$2 | 57.1,68.65 61.42,68.65 65.2,68.65 v65.3,68.75 71.8,75.25 71.8,84.9 77.8,90.9 94.8,90.9 95.74,89.96 J1.2 | 57.1,68.65 C25.P$2 v57.1,74.8 | 51.7,68.85 51.5,68.65 | 51.5,68.65 49.6,68.65 C22.P$2 50.2,70.5 50.55,70.85 v50.55,74.8 | v36.3,68.3 C13.P$2 42.65,68.3 43,68.65 | v35.7,62.85 36.95,62.85 C6.P$2 40.7,62.8 43,65.1 | C10.P$2 v36.2,59.9 45.6,59.9 46.9,61.2 | v34.7,52.3 34.7,53.8 C12.P$2 50.3,53.9 | 51.5,68.65 57.1,68.65 | v35.03,18.57 35.03,3.68 33.8,2.45 31.5,2.45 | v24,22.65 23.92,22.73 FB2/2.1 | 31.5,2.45 19.02,2.45 R24.P$2 | 31.5,2.45 31.5,3.4 31.59,3.49 | v35.03,18.57 35.24,18.57 41.6,24.93 41.6,30 C48.1 41,30.6 C49.P$1 39.58,30.6 39.2,30.98 39.2,34.3 38.68,34.82 R28.P$2 R29.P$2 | v77,12.2 76.29,12.91 40.69,12.91 v35.03,18.57
  Bottom 1.27: 51.5,68.65 50.3,68.65 43,68.65 43,67.5 | 43,68.3 43,65.3 | 43,65.3 43,65.1 | 43,65.3 46.96,61.34 | 46.9,61.2 50.2,61.2 | L3.2 74.9,7.6 77,9.7 v77,12.2 76.4,12.8 70,12.8 68.5,14.3 68.5,50.5
  Bottom 2.54: J1.2 J1.4
VDD5  (via drill 0.35)  (1 unrouted)
  Top 0.254: R1.P$2 45,23.5 44.2,22.7 R12.P$2 44.15,22.25 C5.P$1 C8.P$1 v40.8,22.25
  Top 0.508: 45.41,18.4 U2.4 44.71,19.1 44.71,20.32 44.2,20.82 R12.P$2 | J6.6 78.78,13.44 66.06,13.44 v65.3,14.2
  Bottom 0.508: v40.8,22.25 42.1,20.95 42.1,14.75 43.1,13.75 64.85,13.75 v65.3,14.2
VDD12  (1 unrouted)
VDD_1.2
  Bottom 0.254: U3.1 30.32,26.4 C46.P$1 C45.P$1
VDD_ENET1
  Bottom 0.254: C44.P$1 27.79,26.41 | 26.36,25.81 C43.1 26.53,26.18 C44.P$1 | C44.P$1 27.79,26.59 28.09,26.9 U3.2
  Bottom 0.508: 26.22,25.95 C43.1 24.05,25.91 FB2/2.2
VDDIN
  Bottom 1.27: J6.3 J6.4 82.84,8.06 81.8,9.1 79.4,9.1 77.1,6.8 L3.1
X_DIR
  Top 0.254: 46.8,73.03 U5.118
X_STEP
  Top 0.254: U5.86 65.61,70.05
XCIN  (1 unrouted)
  Top 0.2: 45.55,41.7 45.55,41.4
  Top 0.254: U5.20 49.35,45.75 47.8,44.2 C19.P$1 46.6,44.2 45.55,43.15 45.55,41.7
XCOUT
  Top 0.2: 48.05,41.5 X2.P$2
  Top 0.254: U5.21 49.85,44.73 C24.P$1 48.45,44.2 48.05,43.8 48.05,41.5
XII
  Bottom 0.254: U3.8 33.35,31.4 32.94,31.81 26.12,31.81 24.92,33.01 C42.P$1 24.92,32.71 24.66,32.45 22.11,32.45 U$3.1
XOO
  Bottom 0.254: U3.7 32.85,30.82 32.38,31.29 25.27,31.29 C41.P$1 24.87,31.58 24.55,31.9 19.95,31.9 19.65,31.61 U$3.3
XTAL1
  Top 0.152: 52,39.7 X1.1
  Top 0.254: 52,39.7 52.82,39.7 53.1,39.98 53.1,42.3 50.85,44.55 50.85,44.75 | 50.4,44.4 C7.P$1 50.85,44.75 | U5.23 50.85,45.05 50.85,44.75
XTAL2
  Top 0.2: 54.3,41.6 X1.3
  Top 0.254: U5.24 51.35,45.55 53.25,43.65 C14.P$1 53.25,43.25 54.3,42.2 X1.3
Y_DIR
  Top 0.254: U5.115 48.35,73.08
Y_STEP
  Top 0.254: U5.82 65.5,68.05 65.54,68.09 67.97,68.09